# EAGLE design cc2530-LR-standalone-router (EAGLE 9.6.2)
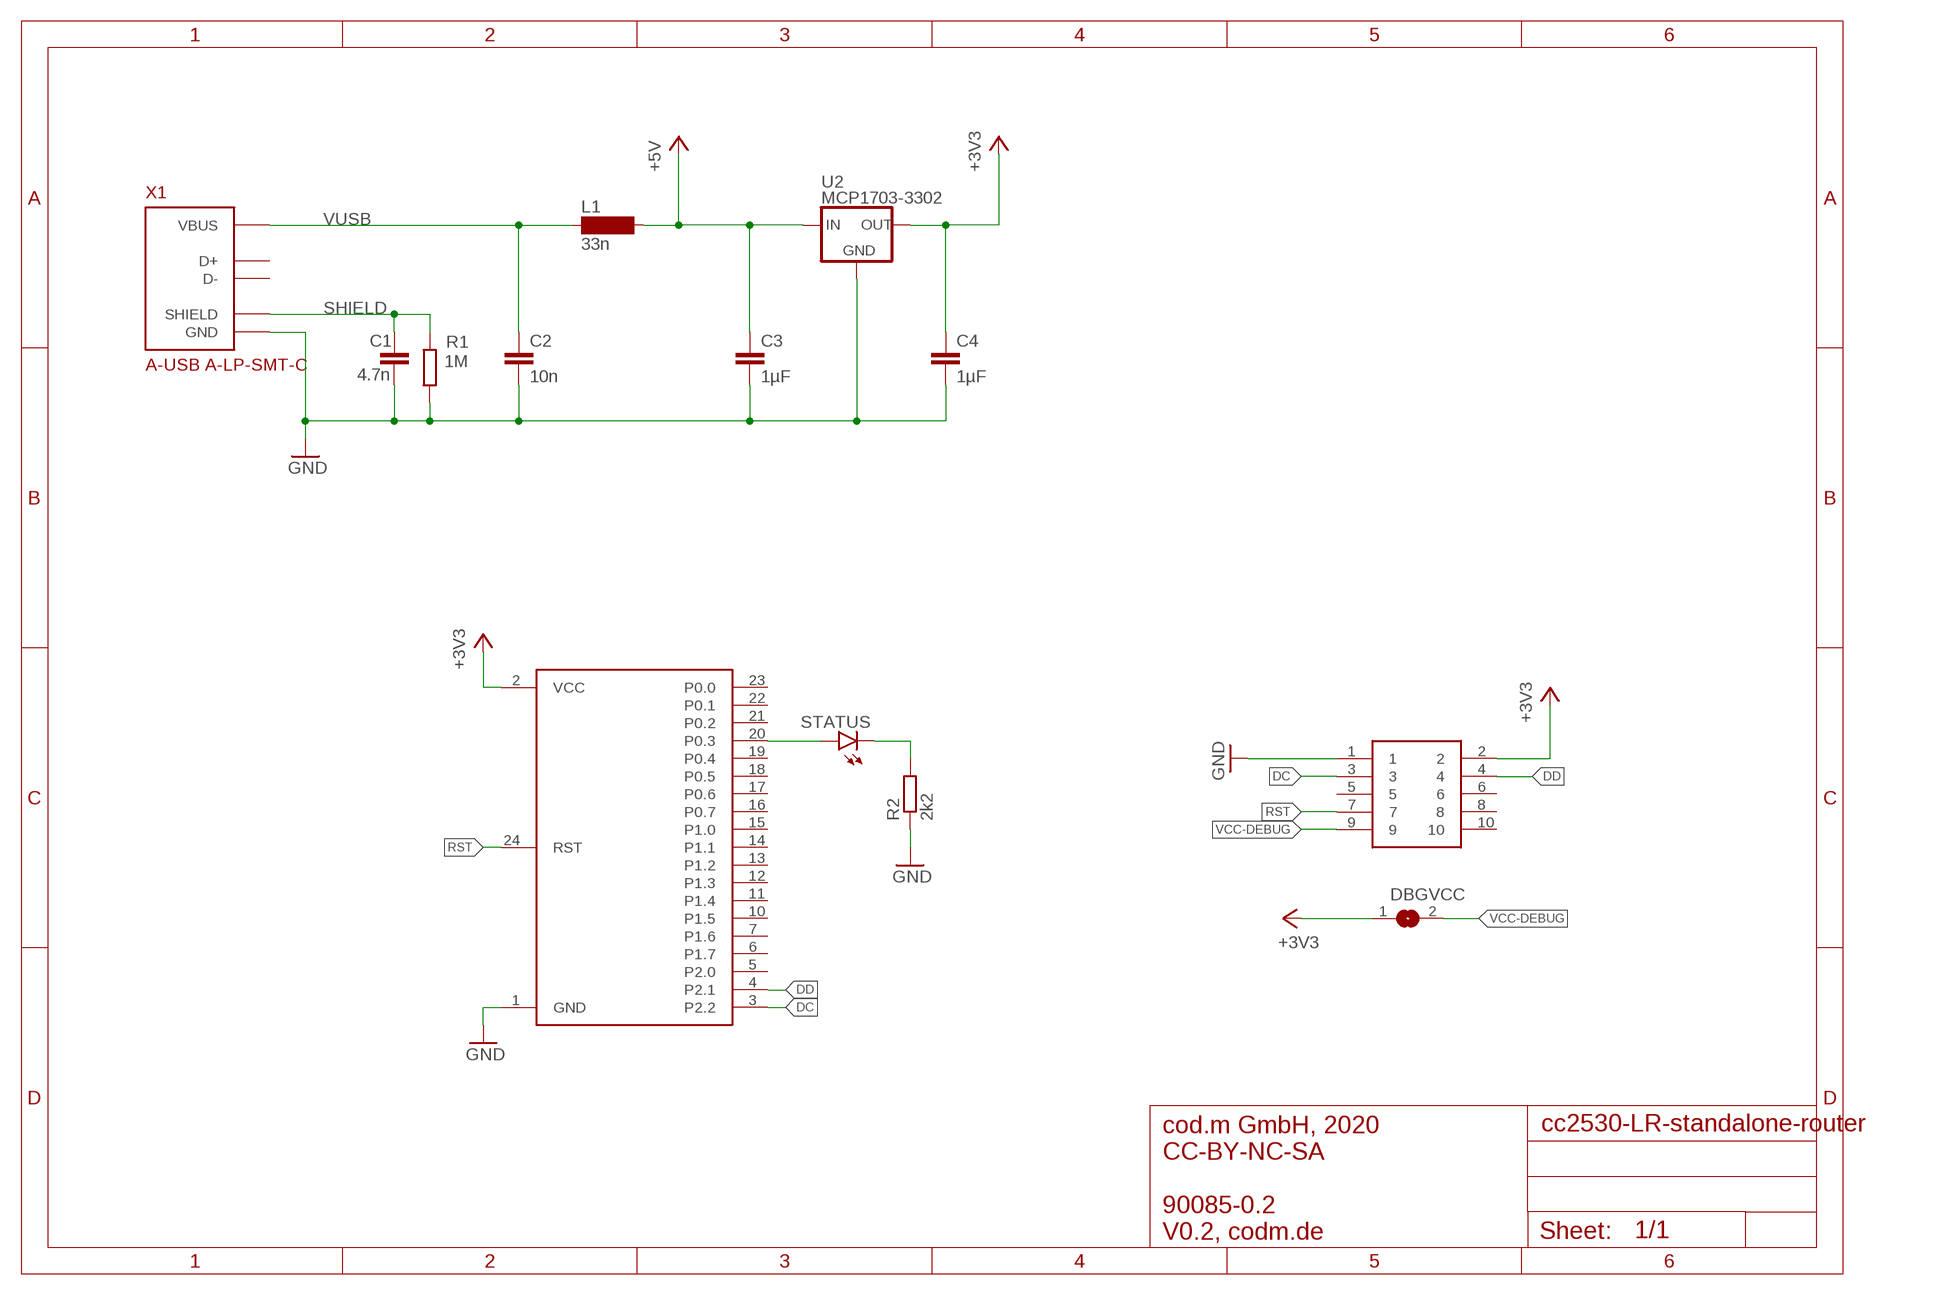
[diagram p0: schematic, sheet 1]

## Parts
C1  4.7n  C-EUC1206  [C1206]
C2  10n  C-EUC1206  [C1206]
C3  1µF  C-EUC1206  [C1206]
C4  1µF  C-EUC1206  [C1206]
DBGVCC  SJ  [SJ]
DEBUG  20021121-00010C4LF  [2002112100010C4LF]
L1  33n  SM-1206  [SM-1206]
R1  1M  R-EU_R1206  [R1206]
R2  2k2  R-EU_R1206  [R1206]
STATUS  LEDCHIPLED_1206  [CHIPLED_1206]
U2  MCP1703-3302  V_REG_SOT-22-3  [SOT-22-3]
U$5  E18-MS1PA2-PCB  [E18-MS1PA2-PCB]
X1  A-USB A-LP-SMT-C  USB-1.0/1.1/2.0-STANDARD-A/B_A-LP-SMT-C  [A-USB_A-LP-SMT-C]

## Nets
+3V3: C4.1 DBGVCC.1 DEBUG.2 U2.3(OUT) U$5.2(VCC)
+5V: C3.1 L1.2 U2.1(IN)
DC: DEBUG.3 U$5.3(P2.2)
DD: DEBUG.4 U$5.4(P2.1)
GND: C1.2 C2.2 C3.2 C4.2 DEBUG.1 R1.2 R2.1 U2.2(GND) U2.4(GND) U$5.1(GND) X1.4(GND)
N$2: R2.2 STATUS.C
N$3: STATUS.A U$5.20(P0.3)
RST: DEBUG.7 U$5.24(RST)
SHIELD: C1.1 R1.1 X1.S1(SHIELD) X1.S2(SHIELD)
VCC-DEBUG: DBGVCC.2 DEBUG.9
VUSB: C2.1 L1.1 X1.1(VBUS)
Unconnected: DEBUG.5 DEBUG.6 DEBUG.8 DEBUG.10 U$5.5(P2.0) U$5.6(P1.7) U$5.7(P1.6) U$5.10(P1.5) U$5.11(P1.4) U$5.12(P1.3) U$5.13(P1.2) U$5.14(P1.1) U$5.15(P1.0) U$5.16(P0.7) U$5.17(P0.6) U$5.18(P0.5) U$5.19(P0.4) U$5.21(P0.2) U$5.22(P0.1) U$5.23(P0.0) X1.2(D-) X1.3(D+)

## Notes on the sheet
- cod.m GmbH, 2020
  CC-BY-NC-SA
  
  90085-0.2
  V0.2, codm.de

## Library data of the parts
C1 C2 = rcl:C-EU: CAPACITOR, European symbol; SPICEPREFIX: C
C3 C4 = resistor:C-EU: CAPACITOR, European symbol
DBGVCC = jumper:SJ: SMD solder JUMPER
DEBUG = 20021121-00010C4LF:20021121-00010C4LF: Headers & Wire Housings 1.27x1.27mm BTB, Hdr Unshrd, SMT, 10 Pos Source: Datasheet; DESCRIPTION: Headers & Wire Housings 1.27x1.27mm BTB, Hdr Unshrd, SMT, 10 Pos; HEIGHT: 4.55mm; MANUFACTURER_NAME: Amphenol; MANUFACTURER_PART_NUMBER: 20021121-00010C4LF; MOUSER_PART_NUMBER: 649-202112100010C4LF; MOUSER_PRICE-STOCK: https://www.mouser.com/Search/Refine.aspx?Keyword=649-202112100010C4LF
L1 = inductor-neosid:SM-1206: INDUCTOR SMD chip inductor; OC_FARNELL: unknown; OC_NEWARK: unknown
R1 R2 = rcl:R-EU_: RESISTOR, European symbol; SPICEPREFIX: R
STATUS = led:LED: LED OSRAM: - CHIPLED LG R971, LG N971, LY N971, LG Q971, LY Q971, LO R971, LY R971 LH N974, LH R974 LS Q976, LO Q976, LY Q976 LO Q996 - Hyper CHIPLED LW Q18S LB Q993, LB Q99A, LB R99A - SideLED LS A670, LO A670, LY A670, LG A670, LP A670 LB A673, LV A673, LT A673, LW A673 LH A674 LY A675 LS A676, LA A676, LO A676, LY A676, LW A676 LS A679, LY A679, LG A679 - Hyper Micro SIDELED® LS Y876, LA Y876, LO Y876, LY Y876 LT Y87S - SmartLED LW L88C, LW L88S LB L89C, LB L89S, LG L890 LS L89K, LO L89K, LY L89K LS L896, LA L896, LO L896, LY L896 - TOPLED LS T670, LO T670, LY T670, LG T670, LP T670 LSG T670, LSP T670, LSY T670, LOP T670, LYG T670 LG T671, LOG T671, LSG T671 LB T673, LV T673, LT T673, LW T673 LH T674 LS T676, LA T676, LO T676, LY T676, LB T676, LH T676, LSB T676, LW T676 LB T67C, LV T67C, LT T67C, LS T67K, LO T67K, LY T67K, LW E67C LS E67B, LA E67B, LO E67B, LY E67B, LB E67C, LV E67C, LT E67C LW T67C LS T679, LY T679, LG T679 LS T770, LO T770, LY T770, LG T770, LP T770 LB T773, LV T773, LT T773, LW T773 LH T774 LS E675, LA E675, LY E675, LS T675 LS T776, LA T776, LO T776, LY T776, LB T776 LHGB T686 LT T68C, LB T68C - Hyper Mini TOPLED® LB M676 - Mini TOPLED Santana® LG M470 LS M47K, LO M47K, LY M47K Source: http://www.osram.convergy.de LUXEON: - LUMILED® LXK2-PW12-R00, LXK2-PW12-S00, LXK2-PW14-U00, LXK2-PW14-V00 LXK2-PM12-R00, LXK2-PM12-S00, LXK2-PM14-U00 LXK2-PE12-Q00, LXK2-PE12-R00, LXK2-PE12-S00, LXK2-PE14-T00, LXK2-PE14-U00 LXK2-PB12-K00, LXK2-PB12-L00, LXK2-PB12-M00, LXK2-PB14-N00, LXK2-PB14-P00, LXK2-PB14-Q00 LXK2-PR12-L00, LXK2-PR12-M00, LXK2-PR14-Q00, LXK2-PR14-R00 LXK2-PD12-Q00, LXK2-PD12-R00, LXK2-PD12-S00 LXK2-PH12-R00, LXK2-PH12-S00 LXK2-PL12-P00, LXK2-PL12-Q00, LXK2-PL12-R00 Source: www.luxeon.com KINGBRIGHT: KA-3528ASYC Source: www.kingbright.com
U2 = dersimn_basics:V_REG
U$5 = e18-ms1pa1-ipx:E18-MS1PA2
X1 = dersimn_connector:USB-1.0/1.1/2.0-STANDARD-A/B

## Board
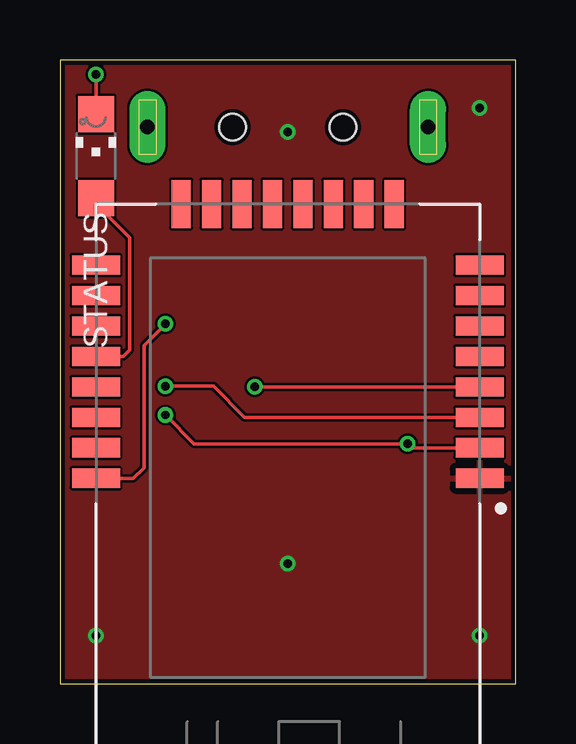
[diagram p1: board, top side]
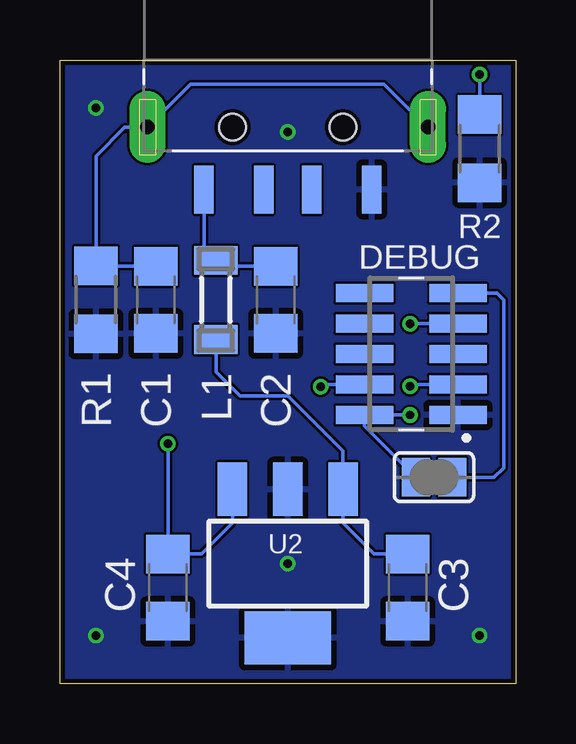
[diagram p2: board, bottom side, seen from below]

Size 19 x 26 mm. Coordinates in mm from the lower left corner, seen from the top.
Outline: 19,26 0,26 0,0 19,0 19,26
Copper layers (1*16): Top 0.035mm / dielectric 1.5mm / Bottom 0.035mm
Design rules "aisler_2_layer *": minimum track width 0.1mm, minimum drill 0.2mm, track to track 0.1mm, track to pad 0.1mm, pad to pad 0.1mm, via to via 0.1mm, smd to smd 0.1mm, copper to edge 0.2mm, drill to drill 0.21mm, minimum pad ring 0.25mm, minimum via ring 0.15mm, stop-mask expansion 0mil, vias tented up to drill 999mil, thermal gap 10mil

### Footprints (pad centres in the part's own frame; a part is rotated, then mirrored left to right if it is on the bottom)
C1206 = smd 1.6 x 1.8: 1 -1.4,0; 2 1.4,0
SJ = smd 1.168 x 1.6: 1 -0.762,0; 2 0.762,0
2002112100010C4LF = smd 0.76 x 2.4: 1 -2.54,-1.95; 2 -2.54,1.95; 3 -1.27,-1.95; 4 -1.27,1.95; 5 0,-1.95; 6 0,1.95; 7 1.27,-1.95; 8 1.27,1.95; 9 2.54,-1.95; 10 2.54,1.95
SM-1206 = smd 1.2 x 1.8: 1 -1.65,0; 2 1.65,0
R1206 = smd 1.6 x 1.803: 1 -1.422,0; 2 1.422,0
CHIPLED_1206 = smd 1.5 x 1.5: A 0,-1.75; C 0,1.75
SOT-22-3 = smd 1.219 x 2.235: 1 -2.311,-3.099; 2 0,-3.099; 3 2.311,-3.099 | smd 3.6 x 2.2: 4 0,3.099
E18-MS1PA2-PCB = smd 0.8 x 2: 1 11.44,8; 2 10.17,8; 3 8.9,8; 4 7.63,8; 5 6.36,8; 6 5.09,8; 7 3.82,8; 8 2.55,8; 17 2.55,-8; 18 3.82,-8; 19 5.09,-8; 20 6.36,-8; 21 7.63,-8; 22 8.9,-8; 23 10.17,-8; 24 11.44,-8 | smd 2 x 0.8: 9 0,4.44; 10 0,3.17; 11 0,1.9; 12 0,0.63; 13 0,-0.64; 14 0,-1.91; 15 0,-3.18; 16 0,-4.45
A-USB_A-LP-SMT-C = smd 2 x 0.8: 1 5.4,-3.5; 2 5.4,-1; 3 5.4,1; 4 5.4,3.5 | drill 0.6 pad 1.5 long: S1 2.8,5.85; S2 2.8,-5.85 | hole 1.1: 2.8,2.3; 2.8,-2.3

### Placement (x,y rotation side)
C1  15,16 270 bottom
C2  10,16 270 bottom
C3  4.5,4 270 bottom
C4  14.5,4 270 bottom
DBGVCC  3.4,8.6 0 bottom
DEBUG  4.35,13.74 90 bottom
L1  12.5,16 270 bottom
R1  17.5,16 270 bottom
R2  1.5,22.3 90 bottom
STATUS  1.5,22 0 top
U2  9.5,5 180 bottom
U$5  9.5,20 270 top
X1  9.5,26 270 bottom

### Tracks (layer width: path | path; a pad name or v marks a point on that pad's centre or on a via)
+3V3  (via drill 0.35)
  Top 0.152: U$5.2 14.67,9.83 v14.5,10 5.6,10 v4.4,11.2
  Bottom 0.152: U2.3 11.81,6.69 13.1,5.4 C4.1 v14.5,10 | DBGVCC.1 6.3,10.74 DEBUG.2 v4.4,11.2
+5V
  Bottom 0.152: C3.1 5.9,5.4 7.19,6.69 U2.1 7.19,9.69 9.5,12 11.5,12 12.5,13 L1.2
DC  (via drill 0.35)
  Top 0.152: v4.4,12.4 6.4,12.4 7.7,11.1 U$5.3
  Bottom 0.152: DEBUG.3 4.33,12.47 v4.4,12.4
DD  (via drill 0.35)
  Top 0.152: v8.13,12.37 U$5.4
  Bottom 0.152: DEBUG.4 8.03,12.47 v8.13,12.37
GND  (via drill 0.35)
  other vias: 17.5,2 1.5,2 17.5,24 9.5,23 9.5,5
  pour Top: 19,26 0,26 0,0 19,0
  pour Bottom: 19,26 0,26 0,0 19,0
N$2  (via drill 0.35)
  Top 0.152: v1.5,25.4 STATUS.C
  Bottom 0.152: R2.2 v1.5,25.4
N$3
  Top 0.152: STATUS.A 1.5,20 2.9,18.6 2.9,13.9 2.64,13.64 U$5.20
RST  (via drill 0.35)
  Top 0.152: U$5.24 3.06,8.56 3.5,9 3.5,14.1 v4.4,15
  Bottom 0.152: DEBUG.7 v4.39,15.01 v4.4,15
SHIELD
  Bottom 0.152: C1.1 17.48,17.4 R1.1 17.5,22 16.3,23.2 X1.S2 13.55,25 5.5,25 3.7,23.2 X1.S1
VCC-DEBUG
  Bottom 0.152: DEBUG.9 0.78,16.28 0.5,16 0.5,9 0.9,8.6 DBGVCC.2
VUSB
  Bottom 0.152: X1.1 13,18.15 L1.1 12.25,17.4 C2.1